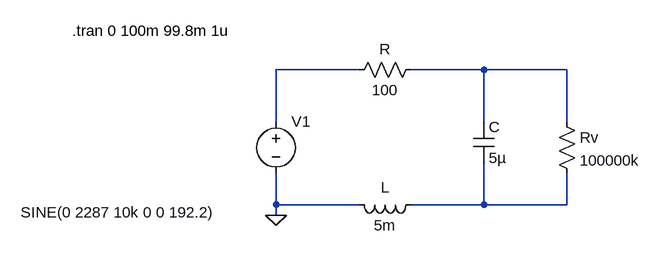
[diagram p0: schematic RTR806_Class_12_20231012_Investigation_of_powers_and_CW1.asc]
RTR806_Class_12_20231012_Investigation_of_powers_and_CW1.asc, the LTspice schematic file:
Version 4
SHEET 1 880 680
WIRE 160 32 32 32
WIRE 352 32 240 32
WIRE 480 32 352 32
WIRE 32 112 32 32
WIRE 352 112 352 32
WIRE 480 112 480 32
WIRE 32 240 32 192
WIRE 160 240 32 240
WIRE 352 240 352 176
WIRE 352 240 240 240
WIRE 480 240 480 192
WIRE 480 240 352 240
WIRE 32 256 32 240
FLAG 32 256 0
SYMBOL voltage 32 96 R0
WINDOW 3 -393 156 Left 2
WINDOW 123 0 0 Left 0
WINDOW 39 0 0 Left 0
SYMATTR InstName V1
SYMATTR Value SINE(0 2287 10k 0 0 192.2)
SYMBOL res 144 48 R270
WINDOW 0 32 56 VTop 2
WINDOW 3 0 56 VBottom 2
SYMATTR InstName R
SYMATTR Value 100
SYMBOL res 464 96 R0
SYMATTR InstName Rv
SYMATTR Value 100000k
SYMBOL ind 256 224 R90
WINDOW 0 5 56 VBottom 2
WINDOW 3 32 56 VTop 2
SYMATTR InstName L
SYMATTR Value 5m
SYMBOL cap 336 112 R0
SYMATTR InstName C
SYMATTR Value 5µ
TEXT -282 -28 Left 2 !.tran 0 100m 99.8m 1u

The netlist it stands for:
* RTR806_Class_12_20231012_Investigation_of_powers_and_CW1.asc
V1 N001 0 SINE(0 2287 10k 0 0 192.2)
R N001 N002 100
Rv N002 N003 100000k
L N003 0 5m
C N002 N003 5µ
.tran 0 100m 99.8m 1u
.backanno
.end